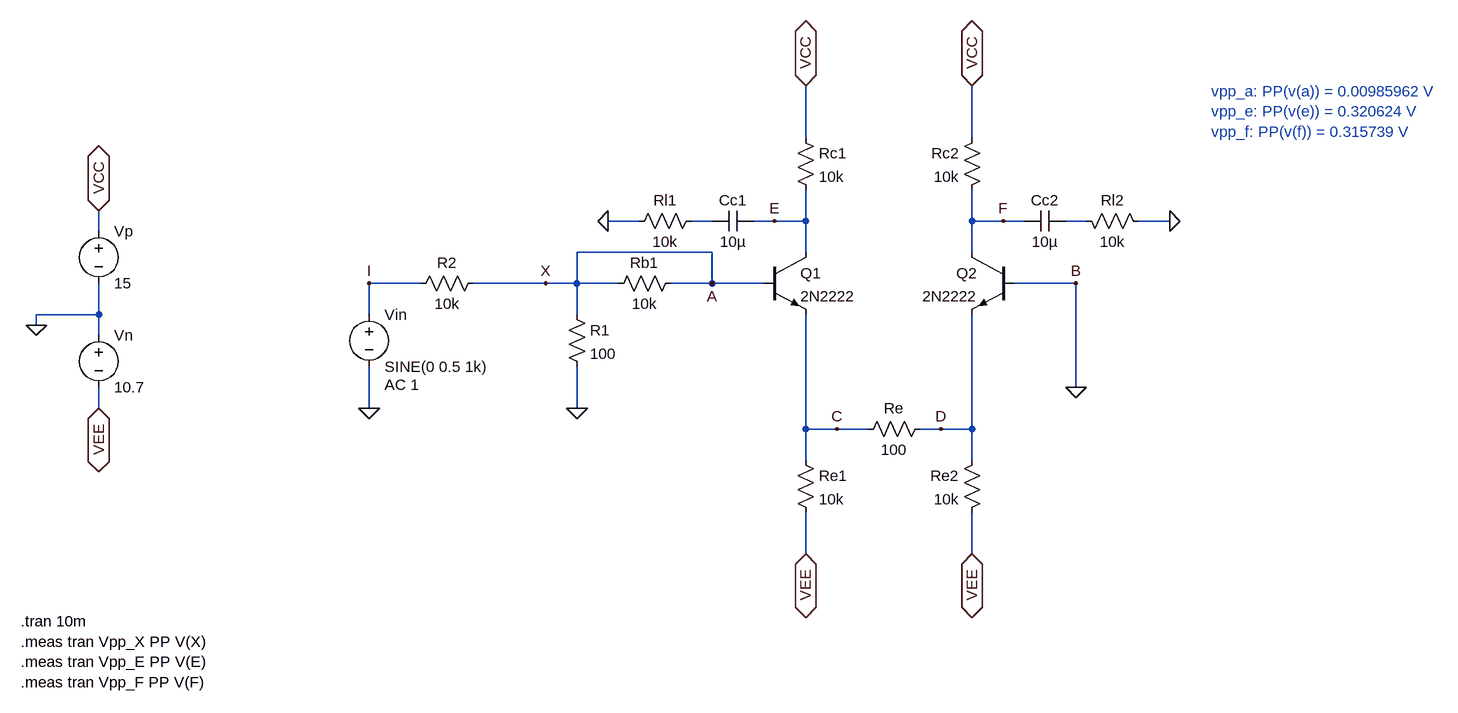
[diagram p0: schematic e1_4_a.asc]
e1_4_a.asc, the LTspice schematic file:
Version 4
SHEET 1 2144 844
WIRE 1136 0 1136 -80
WIRE 1392 0 1392 -80
WIRE 880 128 832 128
WIRE 992 128 960 128
WIRE 1088 128 1056 128
WIRE 1136 128 1136 80
WIRE 1136 128 1088 128
WIRE 1392 128 1392 80
WIRE 1440 128 1392 128
WIRE 1472 128 1440 128
WIRE 1568 128 1536 128
WIRE 1696 128 1648 128
WIRE 48 144 48 112
WIRE 992 176 784 176
WIRE 1136 176 1136 128
WIRE 1392 176 1392 128
WIRE 544 224 464 224
WIRE 736 224 624 224
WIRE 784 224 784 176
WIRE 784 224 736 224
WIRE 848 224 784 224
WIRE 992 224 992 176
WIRE 992 224 928 224
WIRE 1072 224 992 224
WIRE 1552 224 1456 224
WIRE 48 272 48 224
WIRE 48 272 -48 272
WIRE 464 272 464 224
WIRE 784 272 784 224
WIRE -48 288 -48 272
WIRE 48 304 48 272
WIRE 1552 384 1552 224
WIRE 48 416 48 384
WIRE 464 416 464 352
WIRE 784 416 784 352
WIRE 1136 448 1136 272
WIRE 1184 448 1136 448
WIRE 1232 448 1184 448
WIRE 1344 448 1312 448
WIRE 1392 448 1392 272
WIRE 1392 448 1344 448
WIRE 1136 496 1136 448
WIRE 1392 496 1392 448
WIRE 1136 640 1136 576
WIRE 1392 640 1392 576
FLAG -48 288 0
FLAG 48 112 VCC
IOPIN 48 112 BiDir
FLAG 48 416 VEE
IOPIN 48 416 BiDir
FLAG 784 416 0
FLAG 1136 -80 VCC
IOPIN 1136 -80 BiDir
FLAG 1088 128 E
FLAG 992 224 A
FLAG 1136 640 VEE
IOPIN 1136 640 BiDir
FLAG 1184 448 C
FLAG 1392 -80 VCC
IOPIN 1392 -80 BiDir
FLAG 1440 128 F
FLAG 1552 224 B
FLAG 1392 640 VEE
IOPIN 1392 640 BiDir
FLAG 1344 448 D
FLAG 1552 384 0
FLAG 464 416 0
FLAG 464 224 I
FLAG 736 224 X
FLAG 832 128 0
FLAG 1696 128 0
SYMBOL voltage 48 128 R0
SYMATTR InstName Vp
SYMATTR Value 15
SYMBOL voltage 48 288 R0
SYMATTR InstName Vn
SYMATTR Value 10.7
SYMBOL npn 1072 176 R0
SYMATTR InstName Q1
SYMATTR Value 2N2222
SYMBOL res 1120 -16 R0
SYMATTR InstName Rc1
SYMATTR Value 10k
SYMBOL res 768 256 R0
SYMATTR InstName R1
SYMATTR Value 100
SYMBOL res 1120 480 R0
SYMATTR InstName Re1
SYMATTR Value 10k
SYMBOL npn 1456 176 M0
SYMATTR InstName Q2
SYMATTR Value 2N2222
SYMBOL res 1408 -16 M0
SYMATTR InstName Rc2
SYMATTR Value 10k
SYMBOL res 1408 480 M0
SYMATTR InstName Re2
SYMATTR Value 10k
SYMBOL voltage 464 256 R0
WINDOW 123 24 124 Left 2
WINDOW 39 0 0 Left 0
SYMATTR Value2 AC 1
SYMATTR InstName Vin
SYMATTR Value SINE(0 0.5 1k)
SYMBOL res 640 208 R90
WINDOW 0 0 56 VBottom 2
WINDOW 3 32 56 VTop 2
SYMATTR InstName R2
SYMATTR Value 10k
SYMBOL res 944 208 R90
WINDOW 0 0 56 VBottom 2
WINDOW 3 32 56 VTop 2
SYMATTR InstName Rb1
SYMATTR Value 10k
SYMBOL res 1328 432 R90
WINDOW 0 0 56 VBottom 2
WINDOW 3 32 56 VTop 2
SYMATTR InstName Re
SYMATTR Value 100
SYMBOL res 976 112 R90
WINDOW 0 0 56 VBottom 2
WINDOW 3 32 56 VTop 2
SYMATTR InstName Rl1
SYMATTR Value 10k
SYMBOL cap 1056 112 R90
WINDOW 0 0 32 VBottom 2
WINDOW 3 32 32 VTop 2
SYMATTR InstName Cc1
SYMATTR Value 10µ
SYMBOL res 1552 112 M90
WINDOW 0 0 56 VBottom 2
WINDOW 3 32 56 VTop 2
SYMATTR InstName Rl2
SYMATTR Value 10k
SYMBOL cap 1472 112 M90
WINDOW 0 0 32 VBottom 2
WINDOW 3 32 32 VTop 2
SYMATTR InstName Cc2
SYMATTR Value 10µ
TEXT -72 744 Left 2 !.tran 10m\n.meas tran Vpp_X PP V(X)\n.meas tran Vpp_E PP V(E)\n.meas tran Vpp_F PP V(F)
TEXT 1760 -72 Left 2 ;vpp_a: PP(v(a)) = 0.00985962 V\nvpp_e: PP(v(e)) = 0.320624 V\nvpp_f: PP(v(f)) = 0.315739 V

The netlist it stands for:
* e1_4_a.asc
Vp VCC 0 15
Vn 0 VEE 10.7
Q1 E X C 0 2N2222
Rc1 VCC E 10k
R1 X 0 100
Re1 C VEE 10k
Q2 F 0 D 0 2N2222
Rc2 VCC F 10k
Re2 D VEE 10k
Vin I 0 SINE(0 0.5 1k) AC 1
R2 X I 10k
Rb1 X X 10k
Re D C 100
Rl1 N001 0 10k
Cc1 E N001 10µ
Rl2 N002 0 10k
Cc2 F N002 10µ
.model NPN NPN
.model PNP PNP
.lib standard.bjt
.tran 10m
.meas tran Vpp_X PP V(X)
.meas tran Vpp_E PP V(E)
.meas tran Vpp_F PP V(F)
* vpp_a: PP(v(a)) = 0.00985962 V
* vpp_e: PP(v(e)) = 0.320624 V
* vpp_f: PP(v(f)) = 0.315739 V
.backanno
.end